# Altium project BLE_CAMERA_hv2.PrjPcb
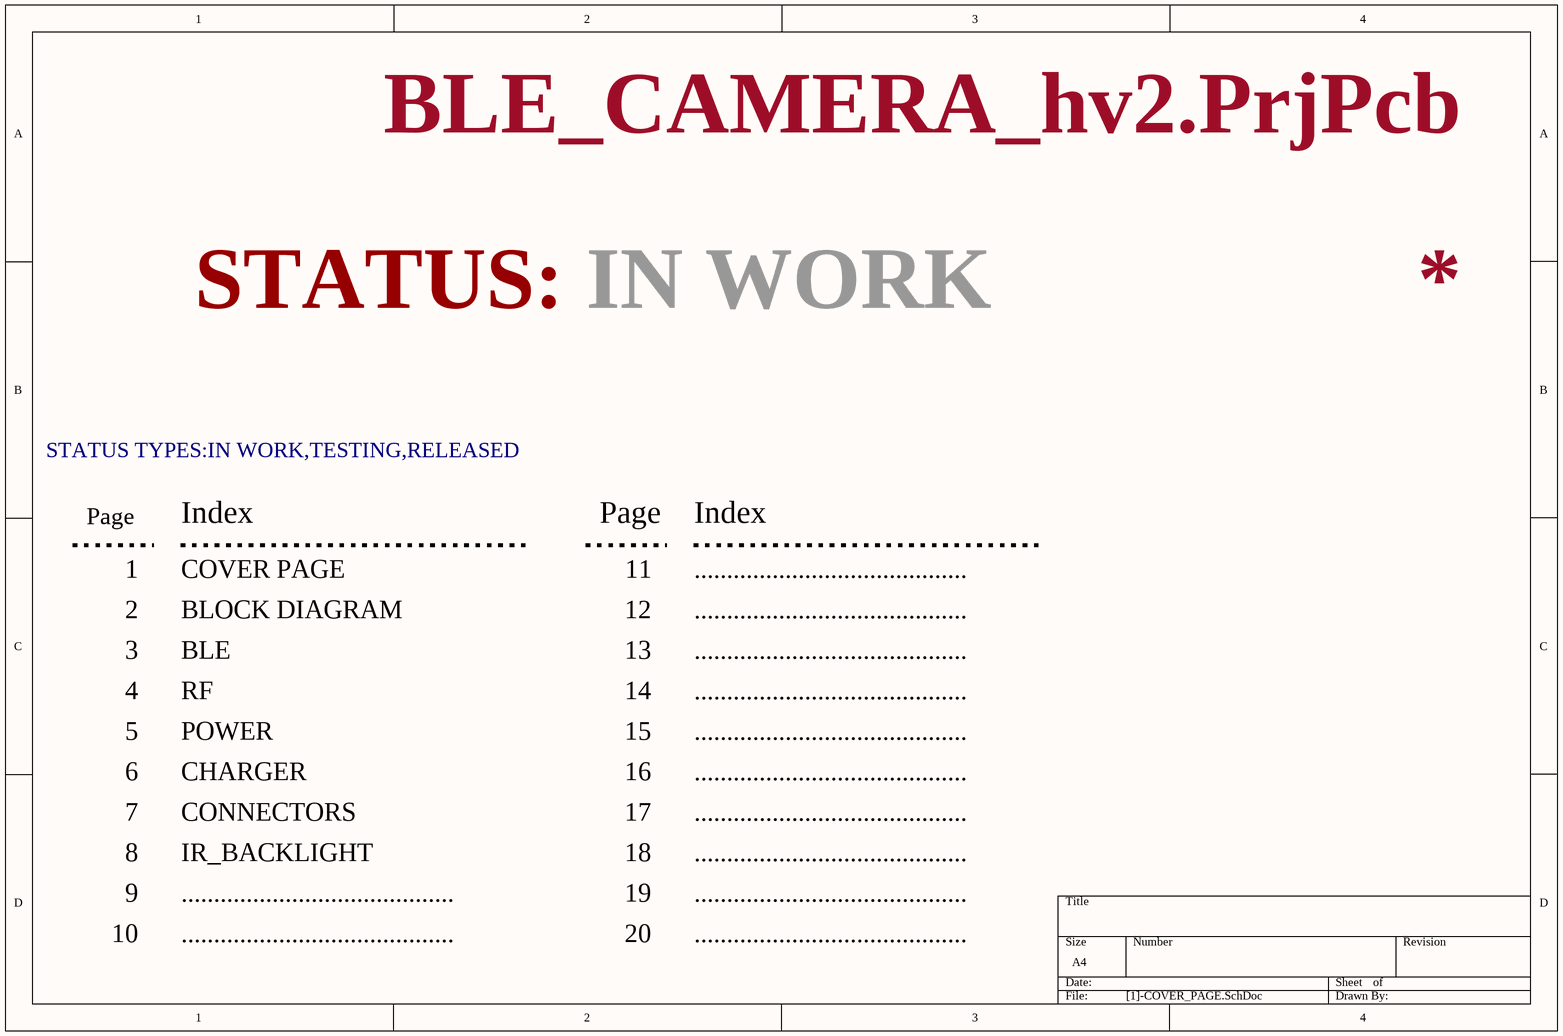
[diagram p0: [1]-COVER_PAGE.SchDoc]
8 sheets, 82 parts. Net scope: flat (ports and power ports of the same name join across sheets).
Board file: BLE_CAMERA_hv2.PcbDoc
Sheets:
  [1]-COVER_PAGE.SchDoc
  [2]-BLOCK_DIAGRAM.SchDoc
  [3]-BLE.SchDoc
  [4]-RF.SchDoc
  [5]-POWER.SchDoc
  [6]-CHARGER.SchDoc
  [7]-CONNECTORS.SchDoc
  [8]-IR_BACKLIGHT.SchDoc

## Sheet [1]-COVER_PAGE.SchDoc
size A4

### Notes on the sheet
- STATUS:
- IN WORK
- STATUS TYPES:IN WORK,TESTING,RELEASED
- Page
- 1
- Index
- COVER PAGE
- 11
- ..........................................
- 2
- BLOCK DIAGRAM
- 12
- 3
- 4
- BLE
- RF
- 13
- 14
- 5
- 6
- POWER
- CHARGER
- 15
- 16
- 7
- CONNECTORS
- 17
- 8
- 9
- IR_BACKLIGHT
- 18
- 19
- 10
- 20

## Sheet [2]-BLOCK_DIAGRAM.SchDoc
size A4
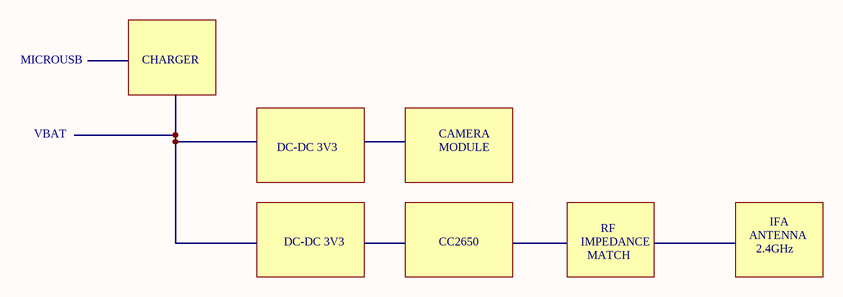
[diagram p1: [2]-BLOCK_DIAGRAM.SchDoc]

### Notes on the sheet
- MICROUSB
- CHARGER
- VBAT
- DC-DC 3V3
- CAMERA
- MODULE
- CC2650
- IMPEDANCE
- RF
- ANTENNA
- 2.4GHz
- IFA
- MATCH

## Sheet [3]-BLE.SchDoc
size A4
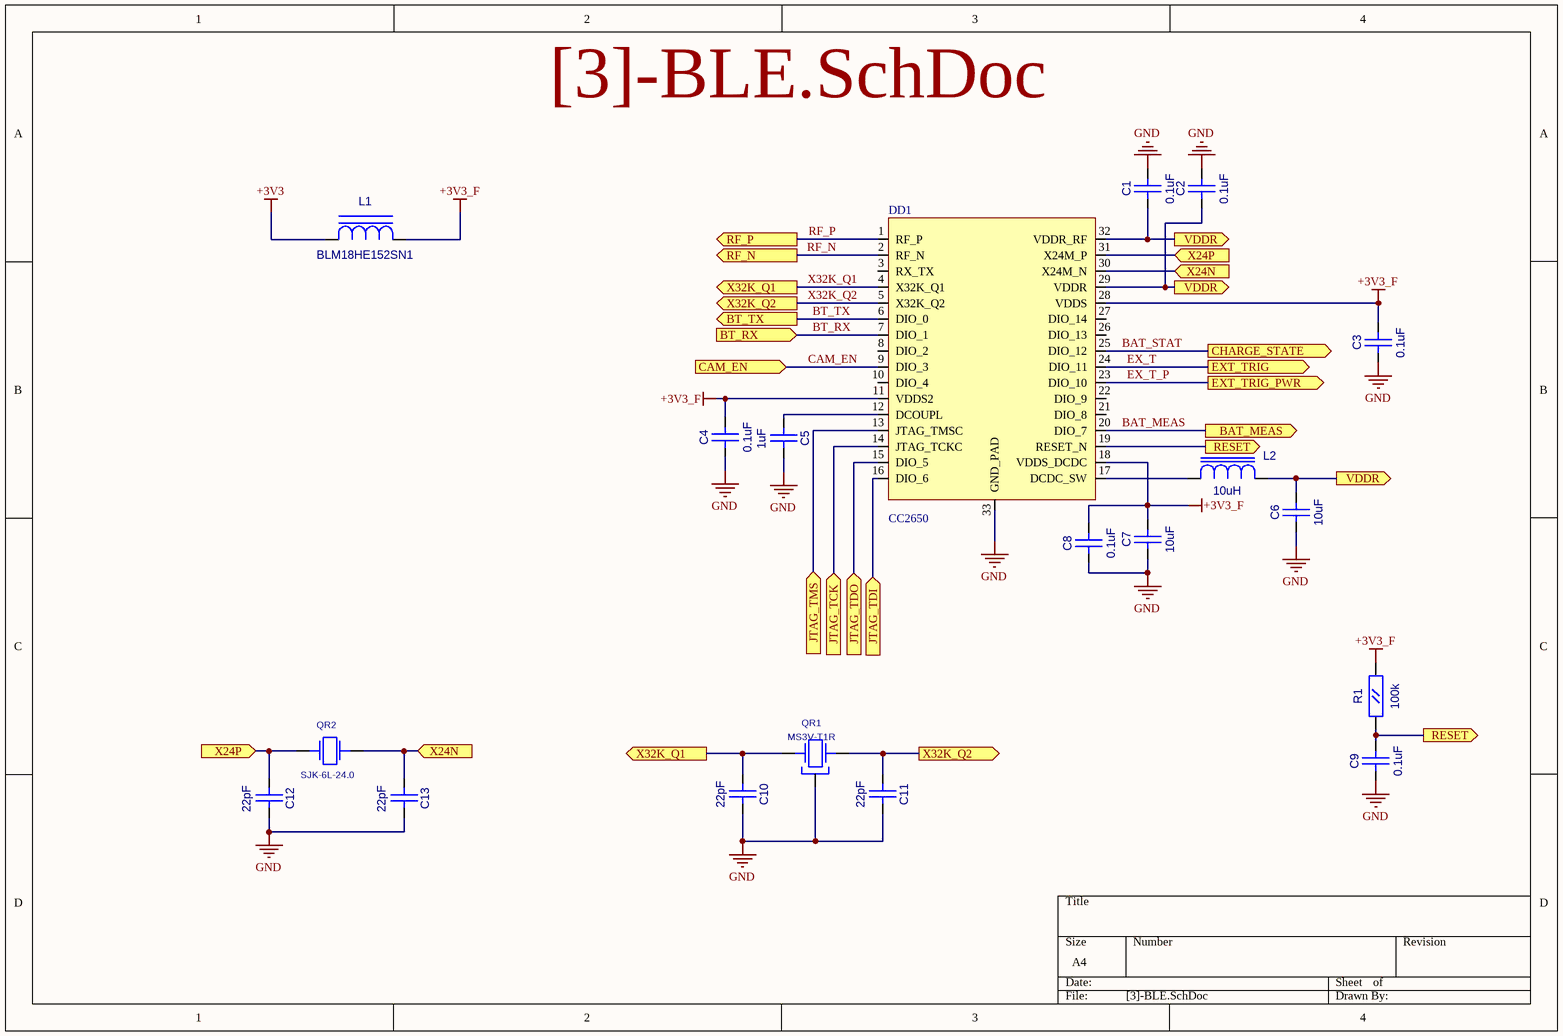
[diagram p2: [3]-BLE.SchDoc]

### Parts
C1  0.1uF  [CC0603]
C2  0.1uF  [CC0603]
C3  0.1uF  [CC0603]
C4  0.1uF  [CC0603]
C5  1uF  [CC0603]
C6  10uF  [CC0805]
C7  10uF  [CC0805]
C8  0.1uF  [CC0603]
C9  0.1uF  [CC0603]
C10  22pF  [CC0603]
C11  22pF  [CC0603]
C12  22pF  [CC0603]
C13  22pF  [CC0603]
DD1  CC2650  [QFN32_TI]
L1  BLM18HE152SN1  [L0603]
L2  10uH  [RC0805]
QR1  MS3V-T1R  [MS3V-T1R]
QR2  SJK-6L-24.0  [AC5032_2]
R1  100k  [RC0603]

### Ports
BAT_MEAS (out), BT_RX (in), BT_TX (out), CAM_EN (in), CHARGE_STATE (out), EXT_TRIG (out), EXT_TRIG_PWR (out), JTAG_TCK (in), JTAG_TDI (in), JTAG_TDO (in), JTAG_TMS (in), RESET (out), RF_N (out), RF_P (out), VDDR (out), X24N (in), X24P (in), X32K_Q1 (out), X32K_Q2 (out)

### Nets
+3V3: L1.1(A)
+3V3_F: C3.2(B) C4.2(B) C7.2(B) C8.2(B) DD1.11(VDDS2) DD1.18(VDDS_DCDC) DD1.28(VDDS) L1.2(C) R1.2(B)
GND: C1.2(B) C2.2(B) C3.1(A) C4.1(A) C5.2(B) C6.1(A) C7.1(A) C8.1(A) C9.1(A) C10.2(B) C11.2(B) C12.2(B) C13.2(B) DD1.33(GND_PAD) QR1.3
BAT_MEAS: DD1.20(DIO_7) ; port BAT_MEAS
BAT_STAT: DD1.25(DIO_12) ; port CHARGE_STATE
BT_RX: DD1.7(DIO_1) ; port BT_RX
BT_TX: DD1.6(DIO_0) ; port BT_TX
CAM_EN: DD1.9(DIO_3) ; port CAM_EN
EX_T: DD1.24(DIO_11) ; port EXT_TRIG
EX_T_P: DD1.23(DIO_10) ; port EXT_TRIG_PWR
JTAG_TCK: DD1.14(JTAG_TCKC) ; port JTAG_TCK
JTAG_TDI: DD1.16(DIO_6) ; port JTAG_TDI
JTAG_TDO: DD1.15(DIO_5) ; port JTAG_TDO
JTAG_TMS: DD1.13(JTAG_TMSC) ; port JTAG_TMS
RESET: C9.2(B) DD1.19(RESET_N) R1.1(A) ; port RESET
RF_N: DD1.2(RF_N) ; port RF_N
RF_P: DD1.1(RF_P) ; port RF_P
X32K_Q1: C10.1(A) DD1.4(X32K_Q1) QR1.2(X2) ; port X32K_Q1
X32K_Q2: C11.1(A) DD1.5(X32K_Q2) QR1.1(X1) ; port X32K_Q2
NetC1_1: C1.1(A) C2.1(A) C6.2(B) DD1.29(VDDR) DD1.32(VDDR_RF) L2.2(B) ; port VDDR
NetC5_1: C5.1(A) DD1.12(DCOUPL)
NetC12_1: C12.1(A) DD1.31(X24M_P) QR2.1 ; port X24P
NetC13_1: C13.1(A) DD1.30(X24M_N) QR2.2 ; port X24N
NetDD1_17: DD1.17(DCDC_SW) L2.1(A)

Not connected (* = marked no-connect by the designer): DD1 3(RX_TX) 8(DIO_2) 10(DIO_4) 21(DIO_8) 22(DIO_9) 26(DIO_13) 27(DIO_14)

### Library data of the parts
C1-C5 C8-C13 = CC0603
  C1-C4 C8 C9: Value: 0.1uF
  C5: Value: 1uF
  C10-C13: Value: 22pF
C6 C7 = CC0805: Value: 10uF
DD1 = CC2650RHB: CC2650RHBT; Value: CC2650
L1 = L0603: Value: BLM18HE152SN1
L2 = L0805: Value: 10uH
QR1 = MS3V-T1R: CRYSTAL_32768 Hz; Value: *
QR2 = AC5032_2: AC5032/2; Value: SJK-6L-24.0
R1 = RC0603: Value: 100k

## Sheet [4]-RF.SchDoc
size A4
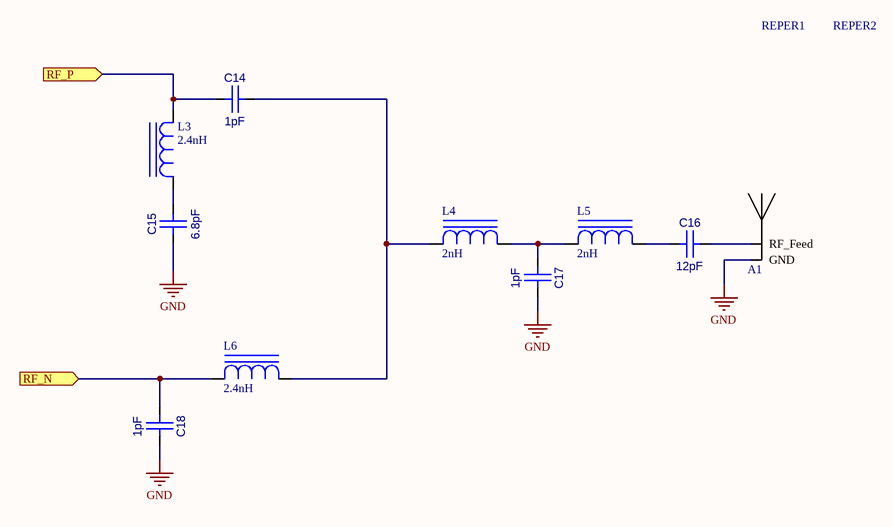
[diagram p3: [4]-RF.SchDoc]

### Parts
A1  Antenna Wi-Fi  [Antenna_WiFi]  (value not drawn)
C14  1pF  [CC0603]
C15  6.8pF  [CC0603]
C16  12pF  [CC0603]
C17  1pF  [CC0603]
C18  1pF  [CC0603]
L3  2.4nH  [L0402]
L4  2nH  [L0402]
L5  2nH  [L0402]
L6  2.4nH  [L0402]
REPER1  REPER1.2  [REPER1.2]  (value not drawn)
REPER2  REPER1.2  [REPER1.2]  (value not drawn)

### Ports
RF_N (in), RF_P (in)

### Nets
GND: A1.2(GND) C15.1(A) C17.2(B) C18.2(B)
RF_N: C18.1(A) L6.1(A) ; port RF_N
RF_P: C14.1(A) L3.2(C) ; port RF_P
NetA1_1: A1.1(RF_Feed) C16.2(B)
NetC14_2: C14.2(B) L4.1(A) L6.2(C)
NetC15_2: C15.2(B) L3.1(A)
NetC16_1: C16.1(A) L5.2(C)
NetC17_1: C17.1(A) L4.2(C) L5.1(A)

Not connected (* = marked no-connect by the designer): REPER1 1; REPER2 1

### Library data of the parts
A1 = Antenna Wi-Fi: 2.43GHz
C14-C18 = CC0603
  C14 C17 C18: Value: 1pF
  C15: Value: 6.8pF
  C16: Value: 12pF
L3-L6 = L0402
  L3 L6: Value: 2.4nH
  L4 L5: Value: 2nH
REPER1 REPER2 = REPER1.2: Value: *

## Sheet [5]-POWER.SchDoc
size A4
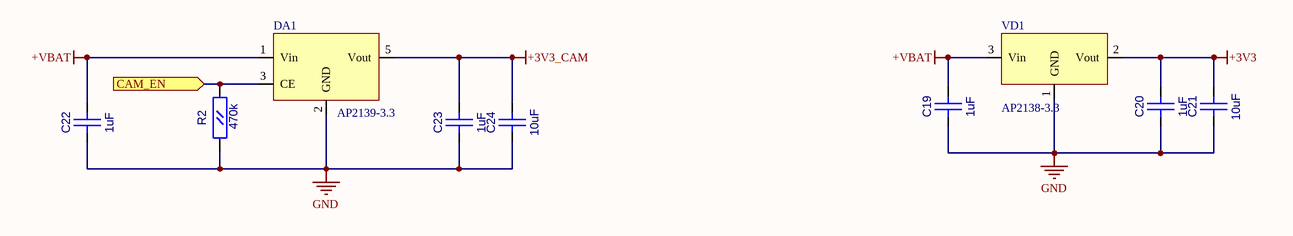
[diagram p4: [5]-POWER.SchDoc]

### Parts
C19  1uF  [CC0603]
C20  1uF  [CC0603]
C21  10uF  [CC0805]
C22  1uF  [CC0603]
C23  1uF  [CC0603]
C24  10uF  [CC0805]
DA1  AP2139-3.3  [SOT23-5]
R2  470k  [RC0603]
VD1  AP2138-3.3  [SOT-23(123)]

### Ports
CAM_EN (in)

### Nets
+3V3: C20.2(B) C21.2(B) VD1.2(Vout)
+3V3_CAM: C23.2(B) C24.2(B) DA1.5(Vout)
+VBAT: C19.2(B) C22.2(B) DA1.1(Vin) VD1.3(Vin)
GND: C19.1(A) C20.1(A) C21.1(A) C22.1(A) C23.1(A) C24.1(A) DA1.2(GND) R2.1(A) VD1.1(GND)
CAM_EN: DA1.3(CE) R2.2(B) ; port CAM_EN

### Library data of the parts
C19 C20 C22 C23 = CC0603: Value: 1uF
C21 C24 = CC0805: Value: 10uF
DA1 = AP2139: Value: AP2139-3.3
R2 = RC0603: Value: 470k
VD1 = AP2138: Value: AP2138-3.3

## Sheet [6]-CHARGER.SchDoc
size A4
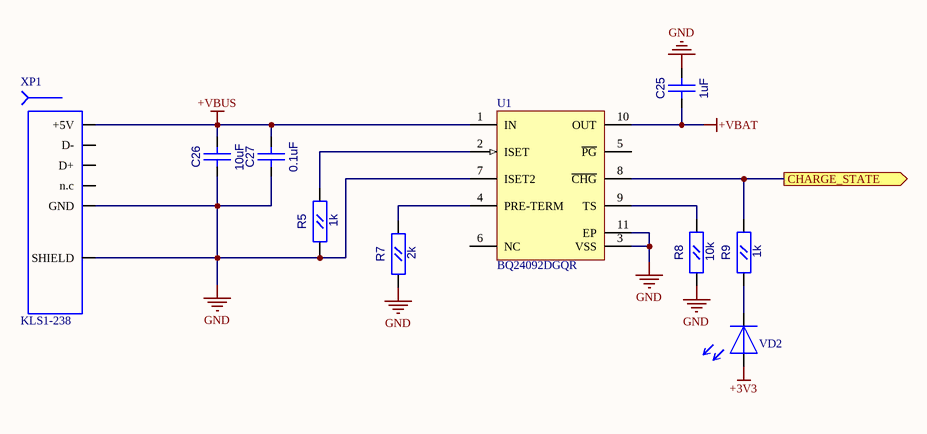
[diagram p5: [6]-CHARGER.SchDoc]

### Parts
C25  1uF  [CC0603]
C26  10uF  [CC0805]
C27  0.1uF  [CC0603]
R5  1k  [RC0603]
R7  2k  [RC0603]
R8  10k  [RC0603]
R9  1k  [RC0603]
U1  BQ24092DGQR  [DGQ10-1675X1445TP_N]
VD2  LED_0805  [LED0805]  (value not drawn)
XP1  KLS1-238  [KLS1-238]

### Ports
CHARGE_STATE (out)

### Nets
+3V3: VD2.1
+VBAT: C25.1(A) U1.10(OUT)
+VBUS: C26.2(B) C27.2(B) U1.1(IN) XP1.1(+5V)
GND: C25.2(B) C26.1(A) C27.1(A) R5.1(A) R7.1(A) R8.1(A) U1.3(VSS) U1.7(ISET2) U1.11(EP) XP1.5(GND) XP1.6(SHIELD)
BAT_STAT: R9.2(B) U1.8(~{CHG}) ; port CHARGE_STATE
NetR5_2: R5.2(B) U1.2(ISET)
NetR7_2: R7.2(B) U1.4(PRE-TERM)
NetR8_2: R8.2(B) U1.9(TS)
NetR9_1: R9.1(A) VD2.2

Not connected (* = marked no-connect by the designer): U1 5(~{PG}) 6(NC); XP1 2(D-) 3(D+) 4(n.c)

### Library data of the parts
C25 C27 = CC0603
  C25: Value: 1uF
  C27: Value: 0.1uF
C26 = CC0805: Value: 10uF
R5 R7-R9 = RC0603
  R5 R9: Value: 1k
  R7: Value: 2k
  R8: Value: 10k
U1 = BQ24092DGQR: 1 A, Single-Input, Single-Cell Li-Ion Battery Charger with Operation Over JEITA and 10 k ohm NTC, 4.5 V, -40 to 150 degC, 10-pin MSOP-PowerPAD (DGQ), Green (RoHS & no Sb/Br); Manufacturer: Texas Instruments; Lead Acid: N; SubFamily: Battery Charge Management; Vin(Min)(V): 4.5; DatasheetVersion: SLUS968C; PackageVersion: revF, Nov-2011; PackageReference: DGQ10-1675X1445TP; PackageDescription: 10-Pin PowerPAD Plastic Small Outline 0.5 mm Pitch, Exposed Pad; Supplier 1: Digi-Key; Supplier Part Number 1: BQ24092DGQR-ND; Supplier 2: Newark; Supplier Part Number 2: 79R7874; Supplier 3: Mouser; Supplier Part Number 3: 595-BQ24092DGQR; Eco-Plan: Green (RoHS & no Sb/Br); Li-Ion: N; Li-Polymer: N; NiCd: N; NiMH: N; Over Voltage Protection: N; Mounting Technology: Surface Mount; PartNumber: BQ24092DGQR; Code_JEDEC: MO-187-BA-T; ComponentLink1Description: Datasheet; ComponentLink1URL: http://www.ti.com/general/docs/lit/getliterature.tsp?genericPartNumber=BQ24092&fileType=pdf
XP1 = MicroUSB KLS1-238: Value: KLS1-238
VD2 = LED_0805: Value: LED_0805

## Sheet [7]-CONNECTORS.SchDoc
size A4
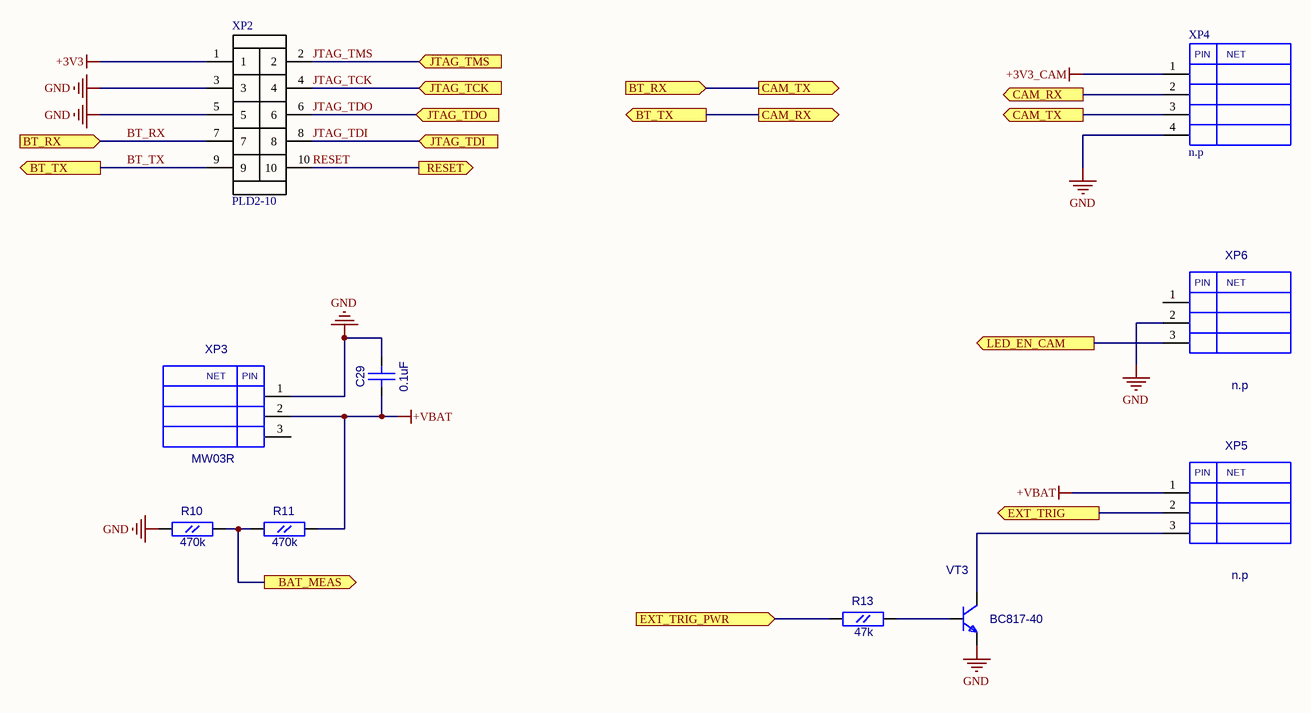
[diagram p6: [7]-CONNECTORS.SchDoc]

### Parts
C29  0.1uF  [CC0603]
R10  470k  [RC0603]
R11  470k  [RC0603]
R13  47k  [RC0603]
VT3  BC817-40  [SOT-23(123)]
XP2  PLD2-10  [PLD2-10]
XP3  MW03R  [MW03R]
XP4  n.p  [PLS2-04]
XP5  n.p  [PLS-03]
XP6  n.p  [PLS2-03]

### Ports
BAT_MEAS (out), BT_RX (in), BT_TX (out), CAM_RX (out), CAM_TX (out), EXT_TRIG (out), EXT_TRIG_PWR (in), JTAG_TCK (in), JTAG_TDI (in), JTAG_TDO (in), JTAG_TMS (in), LED_EN_CAM (out), RESET (out)

### Nets
+3V3: XP2.1
+3V3_CAM: XP4.1
+VBAT: C29.1(A) R11.2(B) XP3.2 XP5.1
GND: C29.2(B) R10.1(A) VT3.2(E) XP2.3 XP2.5 XP3.1 XP4.4 XP6.2
BAT_MEAS: R10.2(B) R11.1(A) ; port BAT_MEAS
BT_RX: XP2.7 XP4.3 ; port BT_RX, port CAM_TX
BT_TX: XP2.9 XP4.2 ; port BT_TX, port CAM_RX
EX_T: XP5.2 ; port EXT_TRIG
EX_T_P: R13.1(A) ; port EXT_TRIG_PWR
JTAG_TCK: XP2.4 ; port JTAG_TCK
JTAG_TDI: XP2.8 ; port JTAG_TDI
JTAG_TDO: XP2.6 ; port JTAG_TDO
JTAG_TMS: XP2.2 ; port JTAG_TMS
RESET: XP2.10 ; port RESET
NetR13_2: R13.2(B) VT3.1(B)
NetR17_1: XP6.3 ; port LED_EN_CAM
NetVT3_3: VT3.3(C) XP5.3

Not connected (* = marked no-connect by the designer): XP3 3; XP6 1

### Notes on the sheet
- (in symbol MW03R) NET; PIN
- (in symbol PLS2-03) PIN; NET
- (in symbol PLS2-04) PIN; NET
- (in symbol PLS03) PIN; NET

### Library data of the parts
C29 = CC0603: Value: 0.1uF
R10 R11 R13 = RC0603
  R10 R11: Value: 470k
  R13: Value: 47k
VT3 = BC846BLT1: NPN 500ma transistor; ComponentField7: Published 29-Sep-2000; OriginalName: BC846BLT1; Value: BC817-40
XP4 = PLS2-04: Value: n.p
XP5 = PLS03: Value: *
XP6 = PLS2-03: Value: n.p
XP2 = PLD2-10: Value: PLD2-10
XP3 = MW03R: Value: *

## Sheet [8]-IR_BACKLIGHT.SchDoc
size A4
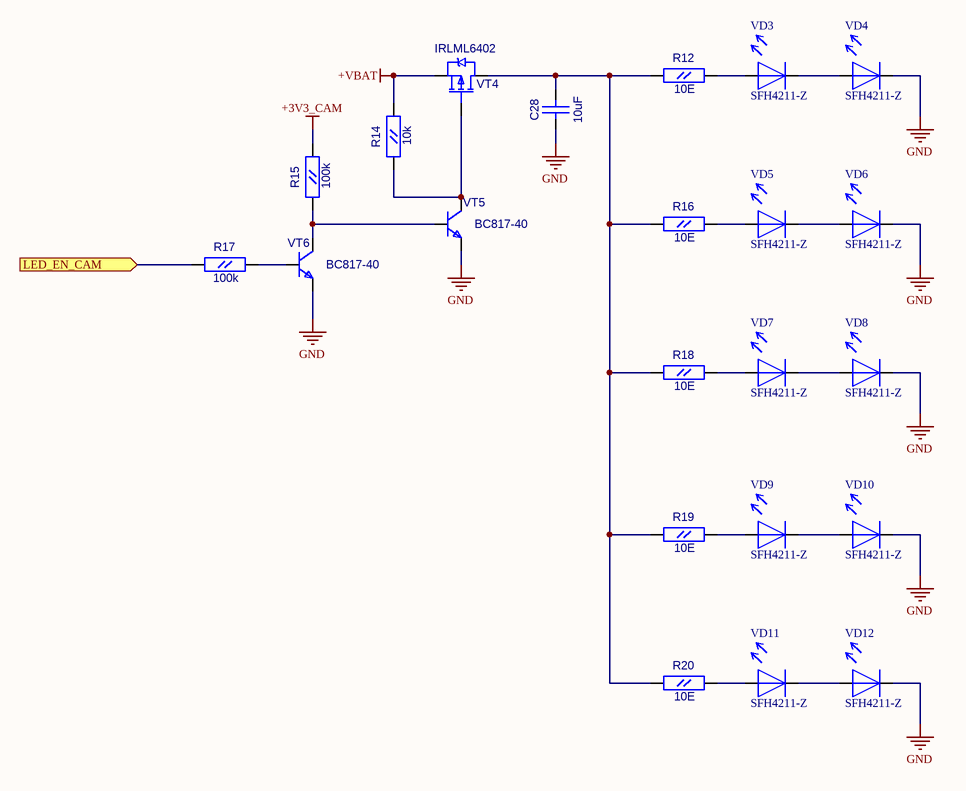
[diagram p7: [8]-IR_BACKLIGHT.SchDoc]

### Parts
C28  10uF  [CC0805]
R12  10E  [RC0603]
R14  10k  [RC0603]
R15  100k  [RC0603]
R16  10E  [RC0603]
R17  100k  [RC0603]
R18  10E  [RC0603]
R19  10E  [RC0603]
R20  10E  [RC0603]
VD3  SFH4211-Z  [LED_3528]
VD4  SFH4211-Z  [LED_3528]
VD5  SFH4211-Z  [LED_3528]
VD6  SFH4211-Z  [LED_3528]
VD7  SFH4211-Z  [LED_3528]
VD8  SFH4211-Z  [LED_3528]
VD9  SFH4211-Z  [LED_3528]
VD10  SFH4211-Z  [LED_3528]
VD11  SFH4211-Z  [LED_3528]
VD12  SFH4211-Z  [LED_3528]
VT4  IRLML6402  [SOT-23(123)]
VT5  BC817-40  [SOT-23(123)]
VT6  BC817-40  [SOT-23(123)]

### Ports
LED_EN_CAM (in)

### Nets
+3V3_CAM: R15.2(B)
+VBAT: R14.2(B) VT4.2(S)
GND: C28.1(A) VD4.2 VD6.2 VD8.2 VD10.2 VD12.2 VT5.2(E) VT6.2(E)
NetC28_2: C28.2(B) R12.1(A) R16.1(A) R18.1(A) R19.1(A) R20.1(A) VT4.3(D)
NetR12_2: R12.2(B) VD3.1
NetR14_1: R14.1(A) VT4.1(G) VT5.3(C)
NetR15_1: R15.1(A) VT5.1(B) VT6.3(C)
NetR16_2: R16.2(B) VD5.1
NetR17_1: R17.1(A) ; port LED_EN_CAM
NetR17_2: R17.2(B) VT6.1(B)
NetR18_2: R18.2(B) VD7.1
NetR19_2: R19.2(B) VD9.1
NetR20_2: R20.2(B) VD11.1
NetVD3_2: VD3.2 VD4.1
NetVD5_2: VD5.2 VD6.1
NetVD7_2: VD7.2 VD8.1
NetVD9_2: VD9.2 VD10.1
NetVD11_2: VD11.2 VD12.1

### Library data of the parts
C28 = CC0805: Value: 10uF
R12 R14-R20 = RC0603
  R12 R16 R18-R20: Value: 10E
  R14: Value: 10k
  R15 R17: Value: 100k
VD3-VD12 = LED_3528: Value: SFH4211-Z
VT4 = IRLML6402: HEXFET Power MOSFET; OriginalName: IRLML5103; ComponentField7: Published 8-Jun-2000; Value: IRLML6402
VT5 VT6 = BC846BLT1: as VT3 on sheet [7]-CONNECTORS; OriginalName: BC846BLT1; Value: BC817-40

## Nets that join several sheets
+3V3: [3]-BLE (L1.1), [5]-POWER (C20.2 C21.2 VD1.2), [6]-CHARGER (VD2.1), [7]-CONNECTORS (XP2.1)
+3V3_CAM: [5]-POWER (C23.2 C24.2 DA1.5), [7]-CONNECTORS (XP4.1), [8]-IR_BACKLIGHT (R15.2)
+VBAT: [5]-POWER (C19.2 C22.2 DA1.1 VD1.3), [6]-CHARGER (C25.1 U1.10), [7]-CONNECTORS (C29.1 R11.2 XP3.2 XP5.1), [8]-IR_BACKLIGHT (R14.2 VT4.2)
GND: [3]-BLE (15 pins), [4]-RF (A1.2 C15.1 C17.2 C18.2), [5]-POWER (9 pins), [6]-CHARGER (11 pins), [7]-CONNECTORS (8 pins), [8]-IR_BACKLIGHT (8 pins)
BAT_MEAS: [3]-BLE (DD1.20), [7]-CONNECTORS (R10.2 R11.1)
BAT_STAT: [3]-BLE (DD1.25), [6]-CHARGER (R9.2 U1.8)
BT_RX: [3]-BLE (DD1.7), [7]-CONNECTORS (XP2.7 XP4.3)
BT_TX: [3]-BLE (DD1.6), [7]-CONNECTORS (XP2.9 XP4.2)
CAM_EN: [3]-BLE (DD1.9), [5]-POWER (DA1.3 R2.2)
EX_T: [3]-BLE (DD1.24), [7]-CONNECTORS (XP5.2)
EX_T_P: [3]-BLE (DD1.23), [7]-CONNECTORS (R13.1)
JTAG_TCK: [3]-BLE (DD1.14), [7]-CONNECTORS (XP2.4)
JTAG_TDI: [3]-BLE (DD1.16), [7]-CONNECTORS (XP2.8)
JTAG_TDO: [3]-BLE (DD1.15), [7]-CONNECTORS (XP2.6)
JTAG_TMS: [3]-BLE (DD1.13), [7]-CONNECTORS (XP2.2)
NetR17_1: [7]-CONNECTORS (XP6.3), [8]-IR_BACKLIGHT (R17.1)
RESET: [3]-BLE (C9.2 DD1.19 R1.1), [7]-CONNECTORS (XP2.10)
RF_N: [3]-BLE (DD1.2), [4]-RF (C18.1 L6.1)
RF_P: [3]-BLE (DD1.1), [4]-RF (C14.1 L3.2)